# EAGLE schematic SCHEM_AF (EAGLE 6.4)
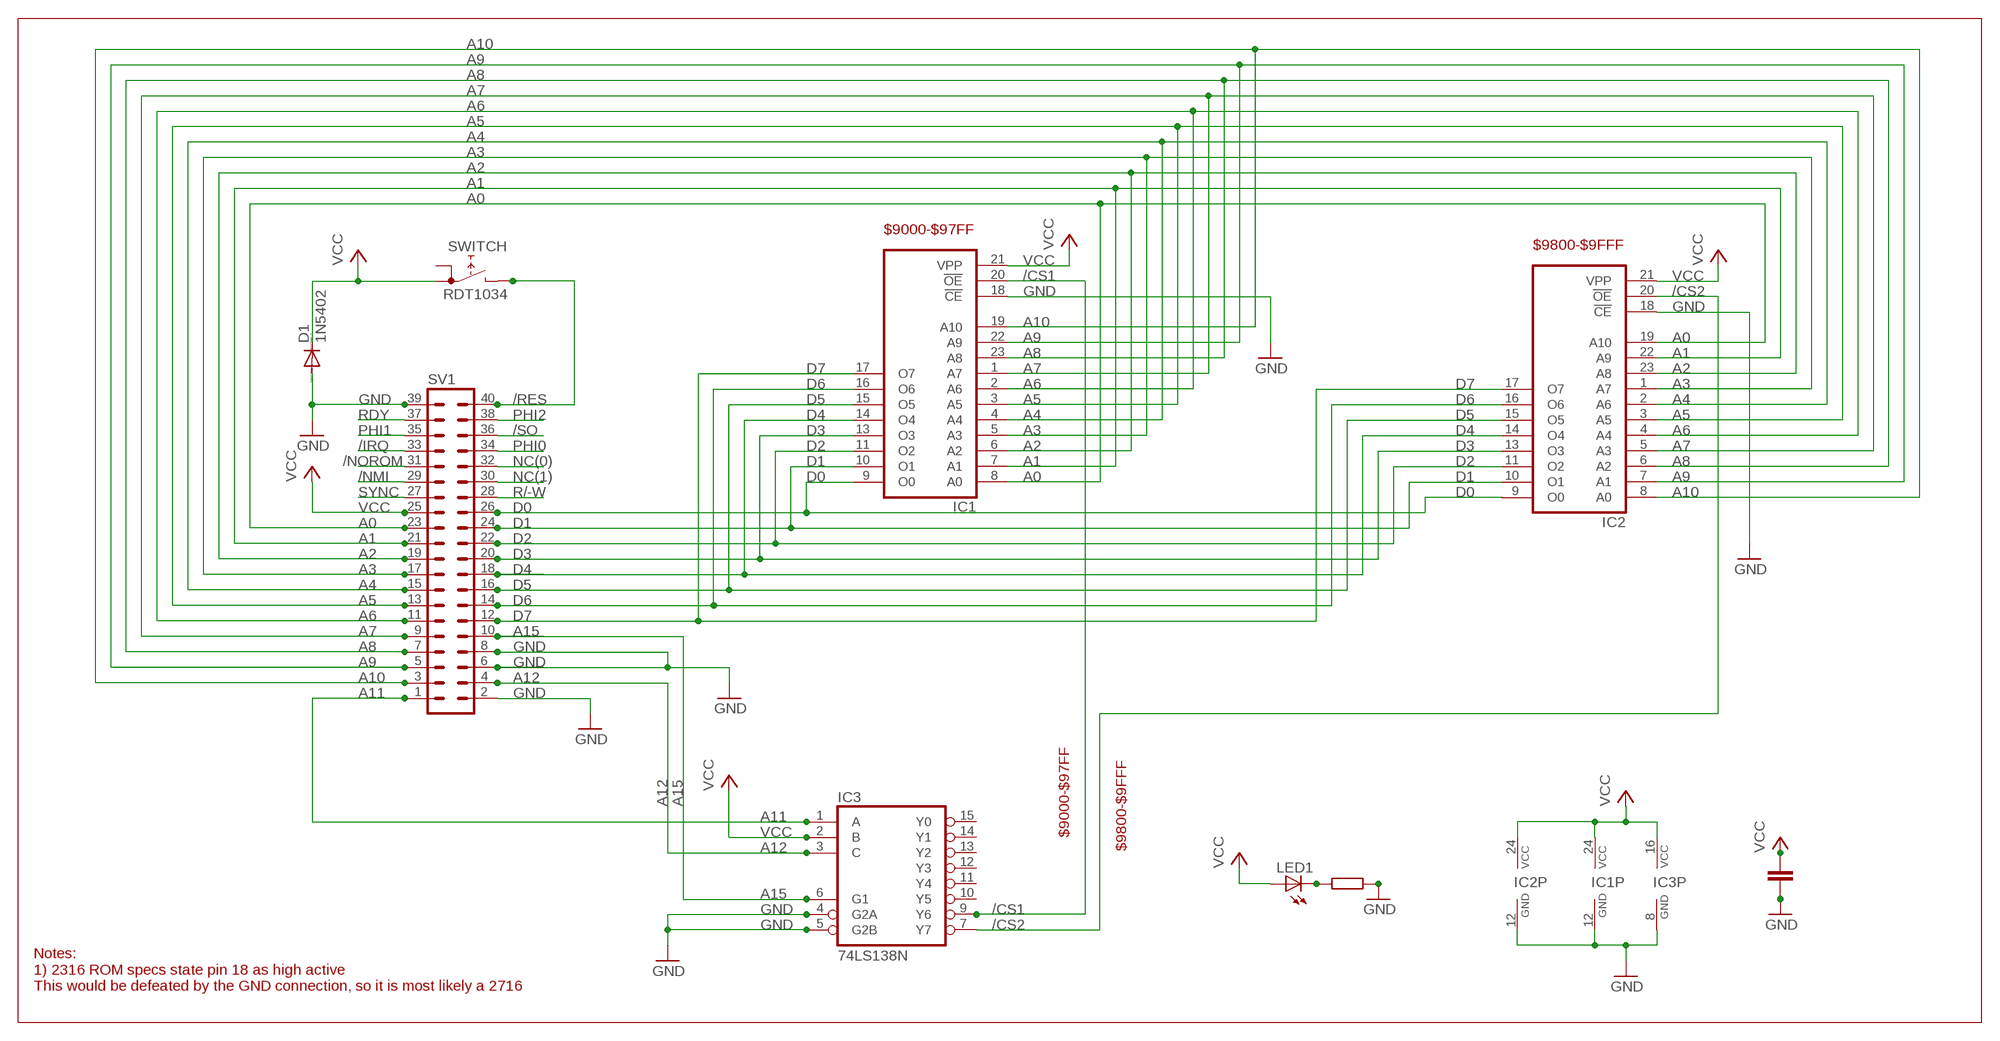
[diagram p0: schematic, sheet 1]

## Parts
D1  1N5402  1N5400  [DO201-15]
IC1  2716  [DIL24]
IC2  2716  [DIL24]
IC3  74LS138N  [DIL16]
LED1  LED5MM  [LED5MM]
SV1  40P  [40P]
SWITCH  RDT1034  [RDT1034]

## Nets
/CS1: IC1.20(!OE) IC3.9(Y6)
/CS2: IC2.20(!OE) IC3.7(Y7)
/IRQ: SV1.33
/NMI: SV1.29
/NOROM: SV1.31
/RES: SV1.40 SWITCH.B
/SO: SV1.36
A0: IC1.8(A0) IC2.19(A10) SV1.23
A1: IC1.7(A1) IC2.22(A9) SV1.21
A2: IC1.6(A2) IC2.23(A8) SV1.19
A3: IC1.5(A3) IC2.1(A7) SV1.17
A4: IC1.4(A4) IC2.2(A6) SV1.15
A5: IC1.3(A5) IC2.3(A5) SV1.13
A6: IC1.2(A6) IC2.4(A4) SV1.11
A7: IC1.1(A7) IC2.5(A3) SV1.9
A8: IC1.23(A8) IC2.6(A2) SV1.7
A9: IC1.22(A9) IC2.7(A1) SV1.5
A10: IC1.19(A10) IC2.8(A0) SV1.3
A11: IC3.1(A) SV1.1
A12: IC3.3(C) SV1.4
A15: IC3.6(G1) SV1.10
D0: IC1.9(O0) IC2.9(O0) SV1.26
D1: IC1.10(O1) IC2.10(O1) SV1.24
D2: IC1.11(O2) IC2.11(O2) SV1.22
D3: IC1.13(O3) IC2.13(O3) SV1.20
D4: IC1.14(O4) IC2.14(O4) SV1.18
D5: IC1.15(O5) IC2.15(O5) SV1.16
D6: IC1.16(O6) IC2.16(O6) SV1.14
D7: IC1.17(O7) IC2.17(O7) SV1.12
GND: D1.A IC1.12(GND) IC1.18(!CE) IC2.12(GND) IC2.18(!CE) IC3.4(G2A) IC3.5(G2B) IC3.8(GND) SV1.2 SV1.6 SV1.8 SV1.39
N$27: LED1.K(C)
NC(0): SV1.32
NC(1): SV1.30
PHI0: SV1.34
PHI1: SV1.35
PHI2: SV1.38
R/-W: SV1.28
RDY: SV1.37
SYNC: SV1.27
VCC: D1.C IC1.21(VPP) IC1.24(VCC) IC2.21(VPP) IC2.24(VCC) IC3.2(B) IC3.16(VCC) LED1.A SV1.25 SWITCH.A1
Unconnected: IC3.10(Y5) IC3.11(Y4) IC3.12(Y3) IC3.13(Y2) IC3.14(Y1) IC3.15(Y0) SWITCH.A

## Notes on the sheet
- $9000-$97FF
- $9800-$9FFF
- $9800-$9FFF
- $9000-$97FF
- Notes: 
  1) 2316 ROM specs state pin 18 as high active
  This would be defeated by the GND connection, so it is most likely a 2716

## Library data of the parts
D1 = diode:1N5400: DIODE standard rectifier, 3 A, 50 V (Motorola)
IC1 IC2 = memory:2716: MEMORY
IC3 = 74xx-eu:74*138: 3-line to 8-line DECODER/DEMULTIPLEXER
LED1 = led:LED: LED OSRAM: - CHIPLED LG R971, LG N971, LY N971, LG Q971, LY Q971, LO R971, LY R971 LH N974, LH R974 LS Q976, LO Q976, LY Q976 LO Q996 - Hyper CHIPLED LW Q18S LB Q993, LB Q99A, LB R99A - SideLED LS A670, LO A670, LY A670, LG A670, LP A670 LB A673, LV A673, LT A673, LW A673 LH A674 LY A675 LS A676, LA A676, LO A676, LY A676, LW A676 LS A679, LY A679, LG A679 - Hyper Micro SIDELED® LS Y876, LA Y876, LO Y876, LY Y876 LT Y87S - SmartLED LW L88C, LW L88S LB L89C, LB L89S, LG L890 LS L89K, LO L89K, LY L89K LS L896, LA L896, LO L896, LY L896 - TOPLED LS T670, LO T670, LY T670, LG T670, LP T670 LSG T670, LSP T670, LSY T670, LOP T670, LYG T670 LG T671, LOG T671, LSG T671 LB T673, LV T673, LT T673, LW T673 LH T674 LS T676, LA T676, LO T676, LY T676, LB T676, LH T676, LSB T676, LW T676 LB T67C, LV T67C, LT T67C, LS T67K, LO T67K, LY T67K, LW E67C LS E67B, LA E67B, LO E67B, LY E67B, LB E67C, LV E67C, LT E67C LW T67C LS T679, LY T679, LG T679 LS T770, LO T770, LY T770, LG T770, LP T770 LB T773, LV T773, LT T773, LW T773 LH T774 LS E675, LA E675, LY E675, LS T675 LS T776, LA T776, LO T776, LY T776, LB T776 LHGB T686 LT T68C, LB T68C - Hyper Mini TOPLED® LB M676 - Mini TOPLED Santana® LG M470 LS M47K, LO M47K, LY M47K Source: http://www.osram.convergy.de LUXEON: - LUMILED® LXK2-PW12-R00, LXK2-PW12-S00, LXK2-PW14-U00, LXK2-PW14-V00 LXK2-PM12-R00, LXK2-PM12-S00, LXK2-PM14-U00 LXK2-PE12-Q00, LXK2-PE12-R00, LXK2-PE12-S00, LXK2-PE14-T00, LXK2-PE14-U00 LXK2-PB12-K00, LXK2-PB12-L00, LXK2-PB12-M00, LXK2-PB14-N00, LXK2-PB14-P00, LXK2-PB14-Q00 LXK2-PR12-L00, LXK2-PR12-M00, LXK2-PR14-Q00, LXK2-PR14-R00 LXK2-PD12-Q00, LXK2-PD12-R00, LXK2-PD12-S00 LXK2-PH12-R00, LXK2-PH12-S00 LXK2-PL12-P00, LXK2-PL12-Q00, LXK2-PL12-R00 Source: www.luxeon.com KINGBRIGHT: KA-3528ASYC Source: www.kingbright.com
SV1 = con-dil:40P: DIL CABLE CONNECTOR
SWITCH = switch:RDT1034: PUSH SWITCH www.radiohm.com